# EAGLE design brushless (EAGLE 5.10)
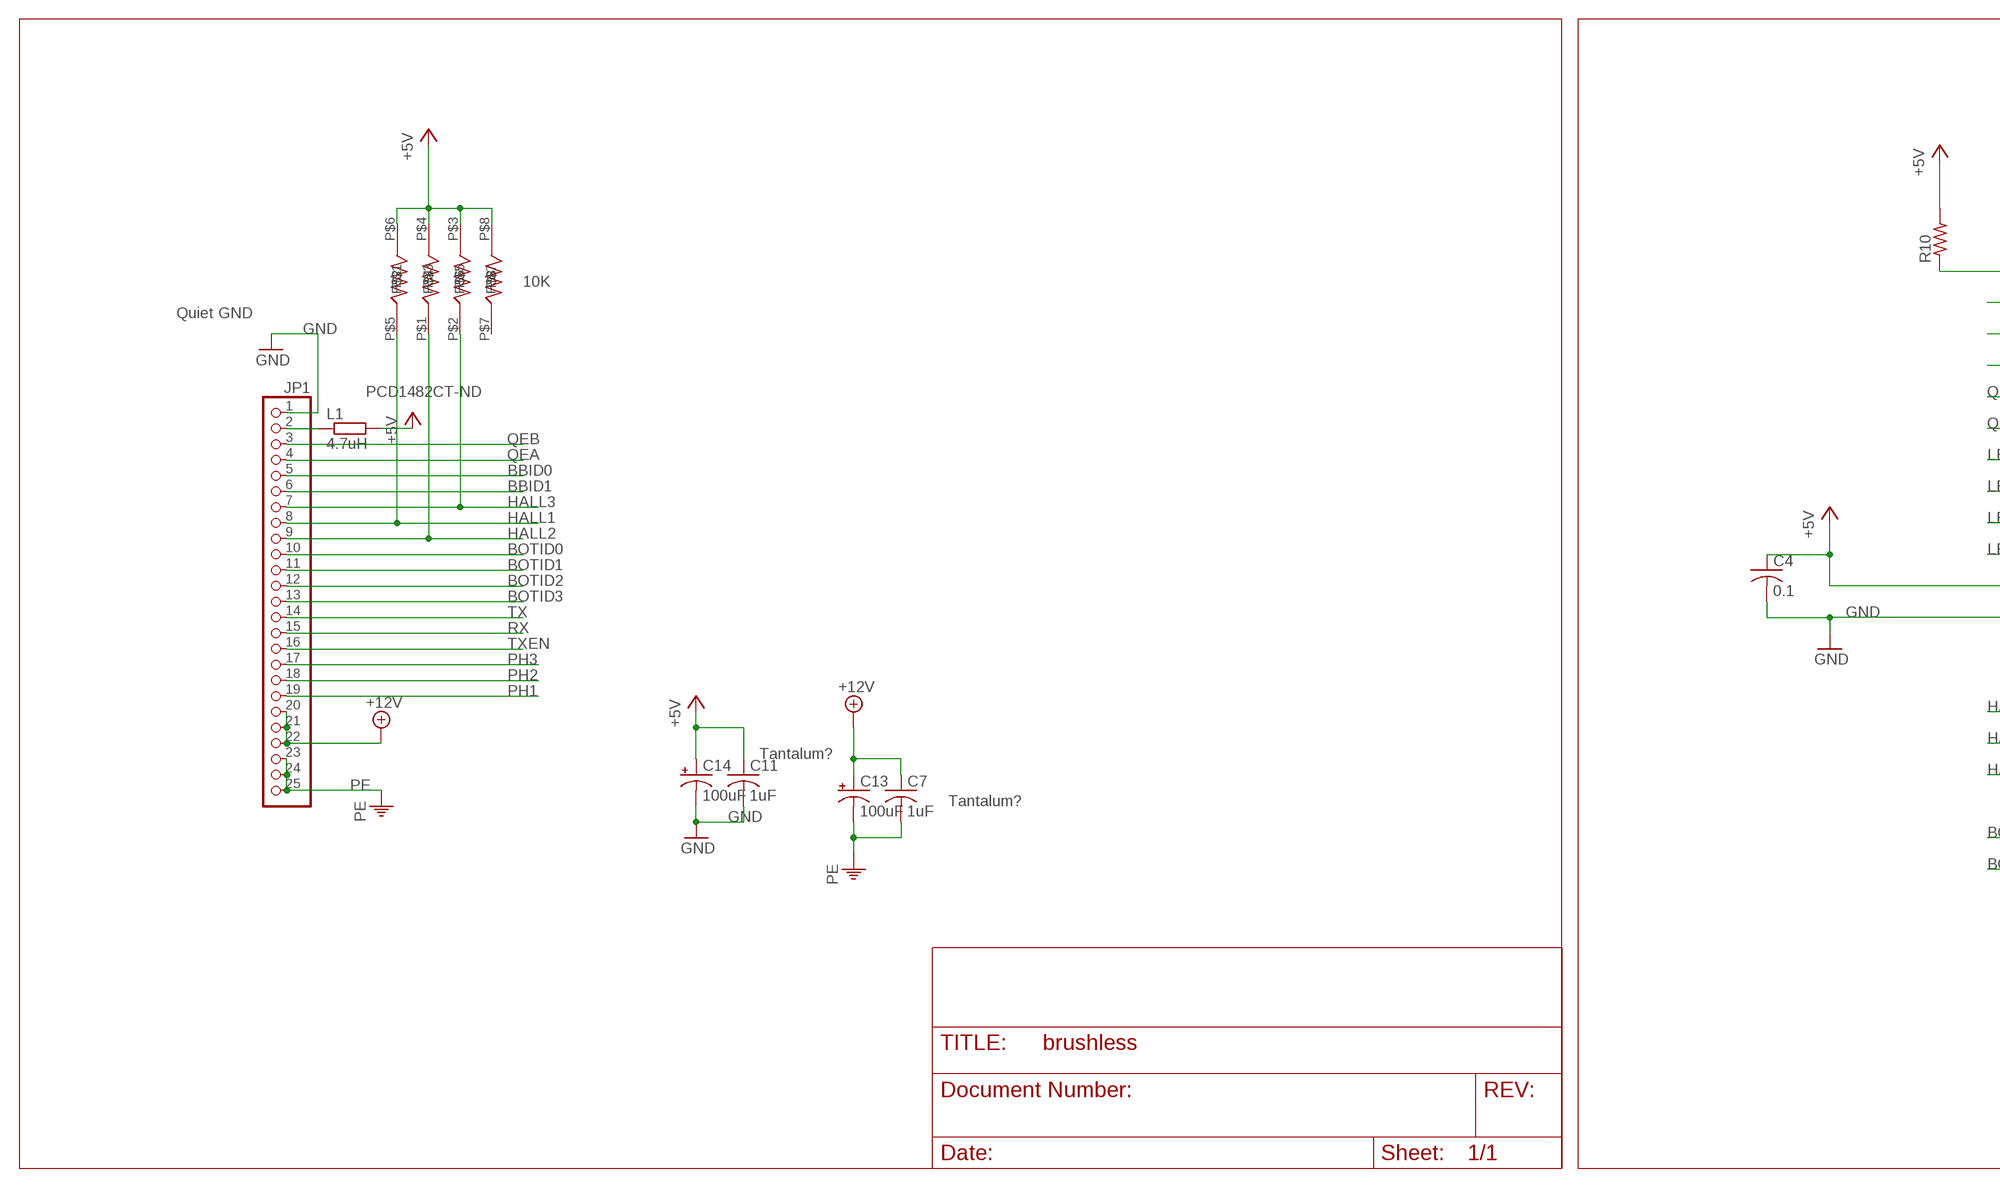
[diagram p0: schematic, sheet 1, part 1 of 2]
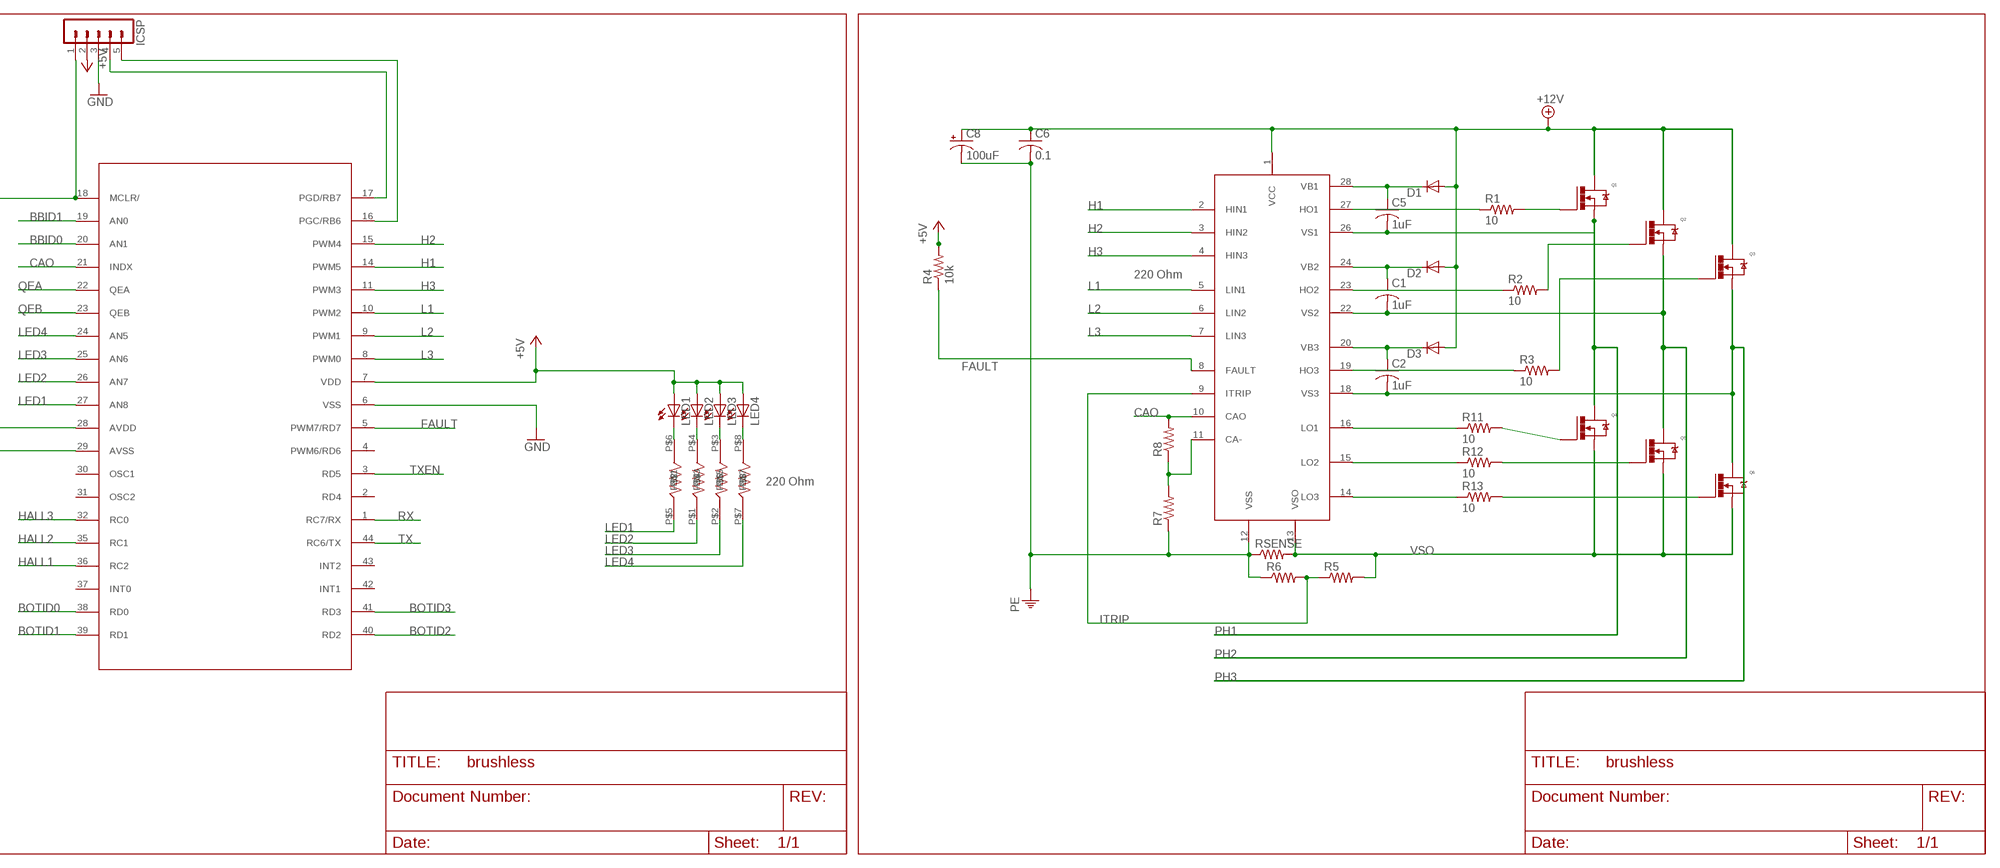
[diagram p1: schematic, sheet 1, part 2 of 2]

## Parts
C1  1uF  C-USC1210  [C1210]
C2  1uF  C-USC1210  [C1210]
C4  0.1  C-USC0805  [C0805]
C5  1uF  C-USC1210  [C1210]
C6  0.1  C-USC0805  [C0805]
C7  1uF  C-USC1210  [C1210]
C8  100uF  CPOL-USE2.5-5  [E2,5-5]
C11  1uF  C-USC1210  [C1210]
C13  100uF  CPOL-USE2.5-5  [E2,5-5]
C14  100uF  CPOL-USE2.5-5  [E2,5-5]
D1  DIODE-MINIMELF  [MINIMELF]
D2  DIODE-MINIMELF  [MINIMELF]
D3  DIODE-MINIMELF  [MINIMELF]
IC1  PIC18F4431S  [TQFP44]
IC2  IR2130S  [SOP28]
ICSP  MA05-1  [MA05-1]
JP1  PINHD-1X25  [1X25]
L1  4.7uH  R-EU_R3225  [R3225]
LED1  LEDCHIPLED_0805  [CHIPLED_0805]
LED2  LEDCHIPLED_0805  [CHIPLED_0805]
LED3  LEDCHIPLED_0805  [CHIPLED_0805]
LED4  LEDCHIPLED_0805  [CHIPLED_0805]
Q1  N-MOSFET  [DPAK]
Q2  N-MOSFET  [DPAK]
Q3  N-MOSFET  [DPAK]
Q4  N-MOSFET  [DPAK]
Q5  N-MOSFET  [DPAK]
Q6  N-MOSFET  [DPAK]
R1  10  R-US_R0805  [R0805]
R2  10  R-US_R0805  [R0805]
R3  10  R-US_R0805  [R0805]
R4  10k  R-US_R0805  [R0805]
R5  R-US_R0805  [R0805]
R6  R-US_R0805  [R0805]
R7  R-US_R0805  [R0805]
R8  R-US_R0805  [R0805]
R10  R-US_R0805  [R0805]
R11  10  R-US_R0805  [R0805]
R12  10  R-US_R0805  [R0805]
R13  10  R-US_R0805  [R0805]
RSENSE  R-US_R2010  [R2010]
U$1  10K  YC164J-10KCT-ND  [0603X4]
U$2  220  YC164J-10KCT-ND  [0603X4]

## Nets
+5MB: JP1.2 L1.1
+5V: C4.1 C11.1 C14.+ IC1.7(VDD) IC1.28(AVDD) ICSP.2 L1.2 LED1.A LED2.A LED3.A LED4.A R4.2 R10.2 U$1.P$3 U$1.P$4 U$1.P$6 U$1.P$8
+12V: C6.1 C7.1 C8.+ C13.+ D1.A D2.A D3.A IC2.1(VCC) JP1.20 JP1.21 JP1.22 Q1.DRAIN Q2.DRAIN Q3.DRAIN
BBID0: IC1.20(AN1) JP1.5
BBID1: IC1.19(AN0) JP1.6
BOTID0: IC1.38(RD0) JP1.10
BOTID1: IC1.39(RD1) JP1.11
BOTID2: IC1.40(RD2) JP1.12
BOTID3: IC1.41(RD3) JP1.13
CA-: IC2.11(CA-) R7.2 R8.1
CAO: IC1.21(INDX) IC2.10(CAO) R8.2
FAULT: IC1.5(PWM7/RD7) IC2.8(FAULT) R4.1
GND: C4.2 C11.2 C14.- IC1.6(VSS) IC1.29(AVSS) ICSP.3 JP1.1
H1: IC1.14(PWM5) IC2.2(HIN1)
H2: IC1.15(PWM4) IC2.3(HIN2)
H3: IC1.11(PWM3) IC2.4(HIN3)
HALL1: IC1.36(RC2) JP1.8 U$1.P$5
HALL2: IC1.35(RC1) JP1.9 U$1.P$1
HALL3: IC1.32(RC0) JP1.7 U$1.P$2
ITRIP: IC2.9(ITRIP) R5.1 R6.2
L1: IC1.10(PWM2) IC2.5(LIN1)
L2: IC1.9(PWM1) IC2.6(LIN2)
L3: IC1.8(PWM0) IC2.7(LIN3)
LED1: IC1.27(AN8) U$2.P$5
LED2: IC1.26(AN7) U$2.P$1
LED3: IC1.25(AN6) U$2.P$2
LED4: IC1.24(AN5) U$2.P$7
N$1: IC2.27(HO1) R1.1
N$2: LED1.C U$2.P$6
N$3: LED2.C U$2.P$4
N$4: C5.1 D1.C IC2.28(VB1)
N$5: C1.1 D2.C IC2.24(VB2)
N$6: Q1.GATE R1.2
N$7: C2.1 D3.C IC2.20(VB3)
N$8: LED3.C U$2.P$3
N$9: IC1.18(MCLR/) ICSP.1 R10.1
N$12: IC2.16(LO1) R11.1
N$13: Q4.GATE R11.2
N$14: IC2.15(LO2) R12.1
N$15: IC2.14(LO3) R13.1
N$16: Q5.GATE R12.2
N$17: Q6.GATE R13.2
N$18: IC2.23(HO2) R2.1
N$19: Q2.GATE R2.2
N$20: Q3.GATE R3.2
N$21: IC2.19(HO3) R3.1
N$22: IC1.17(PGD/RB7) ICSP.4
N$23: IC1.16(PGC/RB6) ICSP.5
N$26: LED4.C U$2.P$8
PE: C6.2 C7.2 C8.- C13.- IC2.12(VSS) JP1.23 JP1.24 JP1.25 R6.1 R7.1 RSENSE.1
PH1: C5.2 IC2.26(VS1) JP1.19 Q1.SOURCE Q4.DRAIN
PH2: C1.2 IC2.22(VS2) JP1.18 Q2.SOURCE Q5.DRAIN
PH3: C2.2 IC2.18(VS3) JP1.17 Q3.SOURCE Q6.DRAIN
QEA: IC1.22(QEA) JP1.4
QEB: IC1.23(QEB) JP1.3
RX: IC1.1(RC7/RX) JP1.15
TX: IC1.44(RC6/TX) JP1.14
TXEN: IC1.3(RD5) JP1.16
VSO: IC2.13(VSO) Q4.SOURCE Q5.SOURCE Q6.SOURCE R5.2 RSENSE.2
Unconnected: IC1.2(RD4) IC1.4(PWM6/RD6) IC1.30(OSC1) IC1.31(OSC2) IC1.37(INT0) IC1.42(INT1) IC1.43(INT2) U$1.P$7

## Notes on the sheet
- 10K
- Quiet GND
- 220 Ohm
- PCD1482CT-ND
- 220 Ohm
- Tantalum?
- Tantalum?

## Library data of the parts
C1 C2 C4-C7 C11 = rcl:C-US: CAPACITOR, American symbol
C8 C13 C14 = rcl:CPOL-US: POLARIZED CAPACITOR, American symbol
D1-D3 = diode:DIODE-: DIODE
IC1 = microchip:PIC18F4431
IC2 = transistor-fet:IR2130
ICSP = con-lstb:MA05-1: PIN HEADER
JP1 = pinhead:PINHD-1X25: PIN HEADER
L1 = resistor:R-EU_: RESISTOR, European symbol
LED1-LED4 = led:LED: LED OSRAM: - CHIPLED LG R971, LG N971, LY N971, LG Q971, LY Q971, LO R971, LY R971 LH N974, LH R974 LS Q976, LO Q976, LY Q976 LO Q996 - Hyper CHIPLED LW Q18S LB Q993, LB Q99A, LB R99A - SideLED LS A670, LO A670, LY A670, LG A670, LP A670 LB A673, LV A673, LT A673, LW A673 LH A674 LY A675 LS A676, LA A676, LO A676, LY A676, LW A676 LS A679, LY A679, LG A679 - Hyper Micro SIDELED® LS Y876, LA Y876, LO Y876, LY Y876 LT Y87S - SmartLED LW L88C, LW L88S LB L89C, LB L89S, LG L890 LS L89K, LO L89K, LY L89K LS L896, LA L896, LO L896, LY L896 - TOPLED LS T670, LO T670, LY T670, LG T670, LP T670 LSG T670, LSP T670, LSY T670, LOP T670, LYG T670 LG T671, LOG T671, LSG T671 LB T673, LV T673, LT T673, LW T673 LH T674 LS T676, LA T676, LO T676, LY T676, LB T676, LH T676, LSB T676, LW T676 LB T67C, LV T67C, LT T67C, LS T67K, LO T67K, LY T67K, LW E67C LS E67B, LA E67B, LO E67B, LY E67B, LB E67C, LV E67C, LT E67C LW T67C LS T679, LY T679, LG T679 LS T770, LO T770, LY T770, LG T770, LP T770 LB T773, LV T773, LT T773, LW T773 LH T774 LS E675, LA E675, LY E675, LS T675 LS T776, LA T776, LO T776, LY T776, LB T776 LHGB T686 LT T68C, LB T68C - Hyper Mini TOPLED® LB M676 - Mini TOPLED Santana® LG M470 LS M47K, LO M47K, LY M47K Source: http://www.osram.convergy.de LUXEON: - LUMILED® LXK2-PW12-R00, LXK2-PW12-S00, LXK2-PW14-U00, LXK2-PW14-V00 LXK2-PM12-R00, LXK2-PM12-S00, LXK2-PM14-U00 LXK2-PE12-Q00, LXK2-PE12-R00, LXK2-PE12-S00, LXK2-PE14-T00, LXK2-PE14-U00 LXK2-PB12-K00, LXK2-PB12-L00, LXK2-PB12-M00, LXK2-PB14-N00, LXK2-PB14-P00, LXK2-PB14-Q00 LXK2-PR12-L00, LXK2-PR12-M00, LXK2-PR14-Q00, LXK2-PR14-R00 LXK2-PD12-Q00, LXK2-PD12-R00, LXK2-PD12-S00 LXK2-PH12-R00, LXK2-PH12-S00 LXK2-PL12-P00, LXK2-PL12-Q00, LXK2-PL12-R00 Source: www.luxeon.com KINGBRIGHT: KA-3528ASYC Source: www.kingbright.com
Q1-Q6 = rfc:N-MOSFET: N-Channel Power Mosfet
R1-R8 R10-R13 RSENSE = rcl:R-US_: RESISTOR, American symbol
U$1 U$2 = rfc:YC164J-10KCT-ND: 4 pack of resistors

## Board
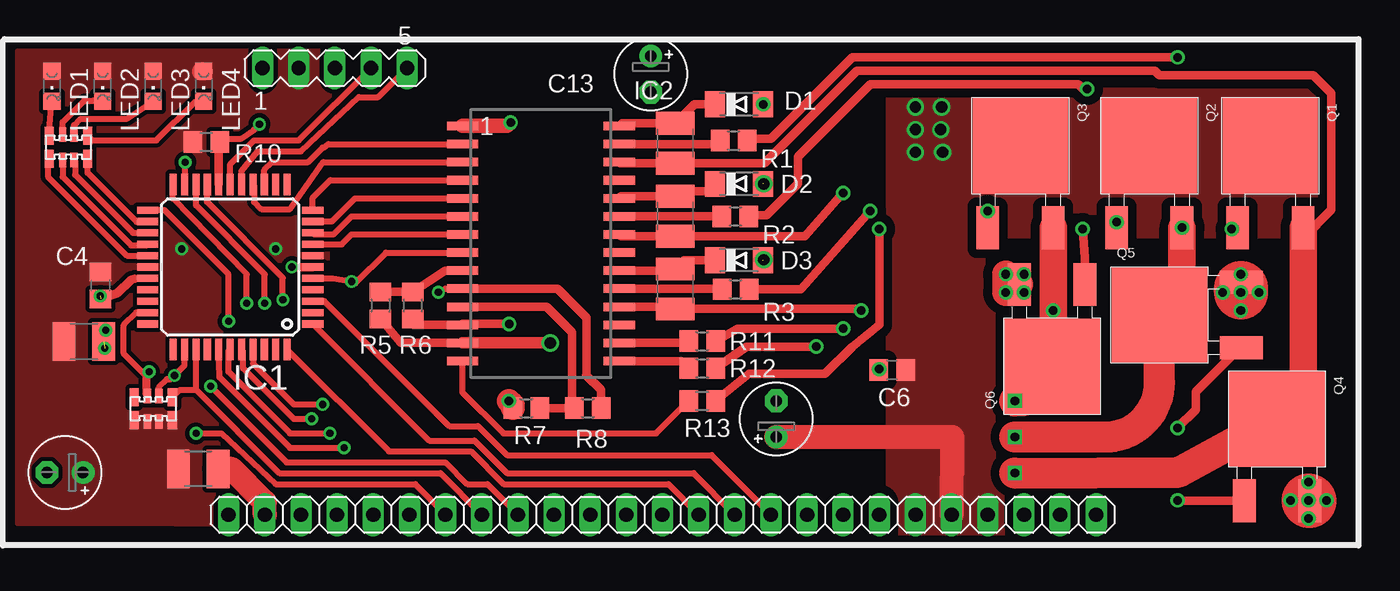
[diagram p2: board, top side]
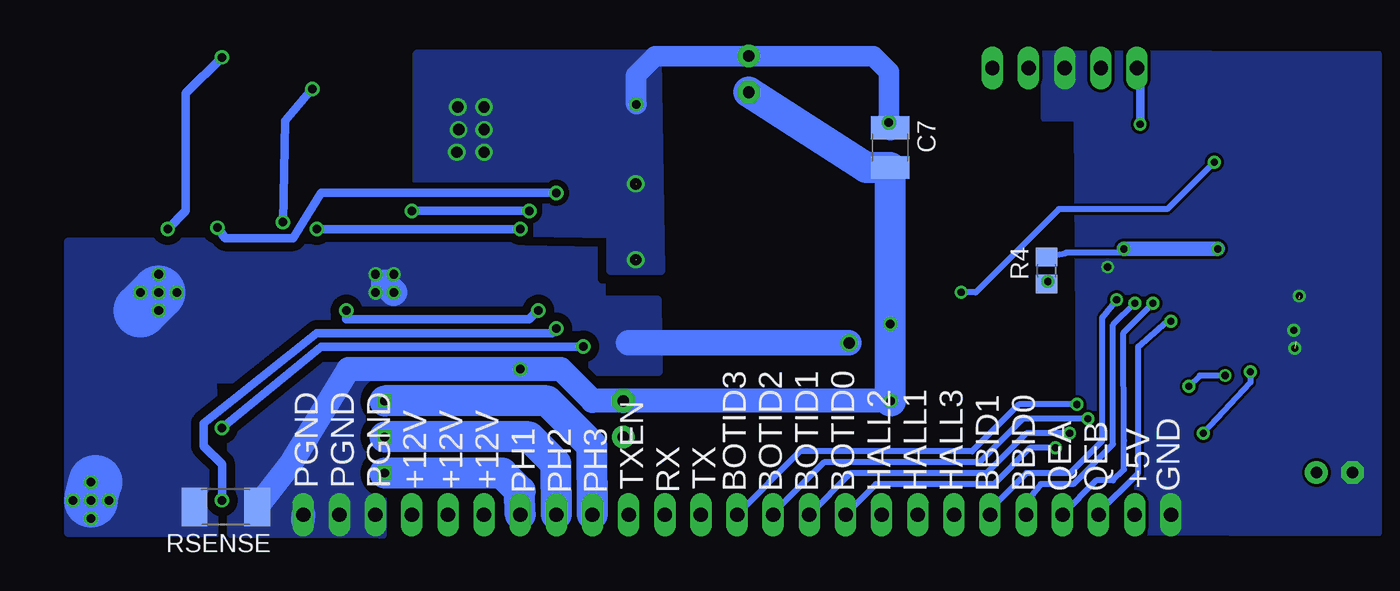
[diagram p3: board, bottom side, seen from below]

No outline drawn. Coordinates in mm, seen from the top.
Copper layers (1*16): Top 0.035mm / dielectric 1.5mm / Bottom 0.035mm
Design rules "default": minimum track width 10mil, minimum drill 24mil, track to track 8mil, track to pad 8mil, pad to pad 8mil, via to via 8mil, smd to smd 8mil, copper to edge 40mil, drill to drill 8mil, minimum pad ring 10mil, minimum via ring 8mil, stop-mask expansion 4mil, vias tented up to drill 0mil, thermal gap 10mil

### Footprints (pad centres in the part's own frame; a part is rotated, then mirrored left to right if it is on the bottom)
C1210 = smd 1.6 x 2.7: 1 -1.4,0; 2 1.4,0
C0805 = smd 1.3 x 1.5: 1 -0.95,0; 2 0.95,0
E2,5-5 = drill 0.813 pad 1.6 round: + -1.27,0 | drill 0.813 pad 1.6 octagon: - 1.27,0
MINIMELF = smd 1.4 x 1.8: A 1.7,0; C -1.7,0
TQFP44@1 = smd 1.5 x 0.5: 1 -5.8,4; 2 -5.8,3.2; 3 -5.8,2.4; 4 -5.8,1.6; 5 -5.8,0.8; 6 -5.8,0; 7 -5.8,-0.8; 8 -5.8,-1.6; 9 -5.8,-2.4; 10 -5.8,-3.2; 11 -5.8,-4; 23 5.8,-4; 24 5.8,-3.2; 25 5.8,-2.4; 26 5.8,-1.6; 27 5.8,-0.8; 28 5.8,0; 29 5.8,0.8; 30 5.8,1.6; 31 5.8,2.4; 32 5.8,3.2; 33 5.8,4 | smd 0.5 x 1.5: 12 -4,-5.8; 13 -3.2,-5.8; 14 -2.4,-5.8; 15 -1.6,-5.8; 16 -0.8,-5.8; 17 0,-5.8; 18 0.8,-5.8; 19 1.6,-5.8; 20 2.4,-5.8; 21 3.2,-5.8; 22 4,-5.8; 34 4,5.8; 35 3.2,5.8; 36 2.4,5.8; 37 1.6,5.8; 38 0.8,5.8; 39 0,5.8; 40 -0.8,5.8; 41 -1.6,5.8; 42 -2.4,5.8; 43 -3.2,5.8; 44 -4,5.8
SOP28 = smd 0.6 x 2.2: 1 -8.255,-5.5; 2 -6.985,-5.5; 3 -5.715,-5.5; 4 -4.445,-5.5; 5 -3.175,-5.5; 6 -1.905,-5.5; 7 -0.635,-5.5; 8 0.635,-5.5; 9 1.905,-5.5; 10 3.175,-5.5; 11 4.445,-5.5; 12 5.715,-5.5; 13 6.985,-5.5; 14 8.255,-5.5; 15 8.255,5.5; 16 6.985,5.5; 17 5.715,5.5; 18 4.445,5.5; 19 3.175,5.5; 20 1.905,5.5; 21 0.635,5.5; 22 -0.635,5.5; 23 -1.905,5.5; 24 -3.175,5.5; 25 -4.445,5.5; 26 -5.715,5.5; 27 -6.985,5.5; 28 -8.255,5.5
MA05-1 = drill 1.016 long: 1 -5.08,0; 2 -2.54,0; 3 0,0; 4 2.54,0; 5 5.08,0
1X25 = drill 1.016 long: 1 -29.21,0; 2 -26.67,0; 3 -24.13,0; 4 -21.59,0; 5 -19.05,0; 6 -16.51,0; 7 -13.97,0; 8 -11.43,0; 9 -8.89,0; 10 -6.35,0; 11 -3.81,0; 12 -1.27,0; 13 1.27,0; 14 3.81,0; 15 6.35,0; 16 8.89,0; 17 11.43,0; 18 13.97,0; 19 16.51,0; 20 19.05,0; 21 21.59,0; 22 24.13,0; 23 26.67,0; 24 29.21,0; 25 31.75,0
R3225 = smd 1.6 x 2.7: 1 -1.4,0; 2 1.4,0
CHIPLED_0805 = smd 1.2 x 1.2: A 0,-1.05; C 0,1.05
DPAK = smd 6.7 x 6.7: DRAIN 0,0 | smd 3 x 1.6: GATE 5.75,-2.3; SOURCE 5.75,2.3
R0805 = smd 1.3 x 1.5: 1 -0.95,0; 2 0.95,0
R2010 = smd 1.8 x 2.7: 1 -2.2,0; 2 2.2,0
0603X4 = smd 0.508 x 1.016: P$1 1.2,-0.1; P$2 2,-0.1; P$3 2,1.7; P$4 1.2,1.7 | smd 0.635 x 1.27: P$5 0.25,0; P$6 0.25,1.6; P$7 2.95,0; P$8 2.95,1.6

### Placement (x,y rotation side)
C1  47.27,23.13 270 top
C2  47.27,18.02 270 top
C4  6.87,18.27 270 top
C5  47.27,28.25 270 top
C6  62.48,12.32 180 top
C7  35.59,27.95 270 bottom
C8  54.36,8.89 90 top
C11  5.7,14.33 0 top
C13  45.53,33.11 270 top
C14  4.38,5.13 180 top
D1  51.73,30.99 0 top
D2  51.73,25.4 0 top
D3  51.73,20.03 0 top
IC1  [TQFP44@1]  15.98,19.56 180 top
IC2  37.81,21.21 270 top
ICSP  23.34,33.53 0 top
JP1  45.09,2.16 0 top
L1  13.74,5.38 180 top
LED1  3.46,32.26 180 top
LED2  7.02,32.26 180 top
LED3  10.57,32.26 180 top
LED4  14.13,32.26 180 top
Q1  89.07,28.07 270 top
Q2  80.56,28.07 270 top
Q3  71.51,28.07 270 top
Q4  89.53,8.89 270 top
Q5  81.28,16.19 0 top
Q6  73.74,12.58 90 top
R1  51.35,28.45 0 top
R2  51.48,23.11 0 top
R3  51.5,18 0 top
R4  24.61,19.3 90 bottom
R5  26.54,16.86 270 top
R6  28.83,16.86 90 top
R7  36.8,9.65 0 top
R8  41.12,9.65 0 top
R10  14.3,28.34 180 top
R11  49.15,14.35 0 top
R12  49.15,12.45 0 top
R13  49.15,10.16 0 top
RSENSE  82.27,2.7 180 bottom
U$1  12.18,10.4 180 top
U$2  3.02,27.18 0 top

### Tracks (layer width: path | path; a pad name or v marks a point on that pad's centre or on a via)
+5MB
  Top 1.676: L1.1 16.08,5.38 18.41,3.05 JP1.2
+5V  (via drill 0.5)
  Top 1.27: LED4.A 13.93,33.31
  Bottom 0.406: R4.2 23.31,20.51 23.24,20.57 19.43,20.57 v19.18,20.83
  Bottom 1.016: v12.57,20.83 v19.18,20.83
  pour Top (isolate 0.305, no thermals): 24.51,34.73 1.02,34.73 1.02,1.52 23.05,1.46 22.73,29.97 24.77,29.97 24.77,30.48
+12V  (via drill 0.6, 0.8)  (2 unrouted)
  Top 1.016: IC2.1 35.45,29.46 v35.69,29.7
  Top 1.676: C8.+ 66.71,7.62 JP1.21
  Bottom 1.422: v35.69,29.7 35.69,33.27 36.79,34.38 C13.+ 52.11,34.38 53.47,33.02 53.47,31.02 D1.A
  Bottom 1.778: v35.69,29.7 C7.1
  other vias: 64.14,29.21 65.91,29.21 64.14,27.62 64.14,30.8 65.98,30.8 66.04,27.62 53.47,25.4 53.47,20.07 53.44,30.99
  pour Bottom (isolate 0.406, rank 3, no thermals): 51.94,34.29 51.69,19.3 55.24,19.3 55.24,21.84 68.83,22.1 68.83,34.54 52.2,34.54
  pour Top (isolate 0.61, no thermals): 93.09,31.88 93.09,21.84 70.74,21.84 70.74,1.02 62.36,1.02 62.36,31.88
BBID0  (via drill 0.5)
  Top 0.406: IC1.20 13.59,23.88 18.41,19.05 v18.41,17.02
  Bottom 0.406: v18.41,17.02 19.94,15.49 19.94,7.11 22.73,4.32 25.02,4.32 26.07,3.02 JP1.5
BBID1  (via drill 0.5)
  Top 0.406: v19.68,17.27 19.68,18.8 14.35,24.13 14.35,25.32 IC1.19
  Bottom 0.406: v19.68,17.27 20.7,16 20.7,7.37 22.99,5.08 26.04,5.08 28.61,2.51 JP1.6
BOTID0  (via drill 0.5 pad 0.25)
  Top 0.406: v24,6.86 20.19,6.86 15.24,11.81 IC1.38
  Bottom 0.406: JP1.10 36.61,4.32 28.32,4.32 25.78,6.86 v24,6.86
BOTID1  (via drill 0.5 pad 0.25)
  Top 0.406: v22.99,7.87 20.19,7.87 15.88,12.19 15.88,13.65 IC1.39
  Bottom 0.406: JP1.11 38.39,5.08 28.83,5.08 26.04,7.87 v22.99,7.87
BOTID2  (via drill 0.5 pad 0.25)
  Top 0.406: v21.72,8.89 20.45,8.89 16.89,12.45 16.89,13.65 IC1.40
  Bottom 0.406: JP1.12 43.85,2.25 40.26,5.84 29.34,5.84 26.29,8.89 v21.72,8.89
BOTID3  (via drill 0.5 pad 0.25)
  Top 0.406: IC1.41 17.59,12.77 20.45,9.91 v22.48,9.91
  Bottom 0.406: v22.48,9.91 26.54,9.91 29.84,6.6 41.94,6.6 JP1.13
CA-
  Top 0.61: 40.01,9.65 R8.1 | IC2.11 38.23,16.76 40.01,14.99 40.01,9.65 | R7.2 40.01,9.65
CAO  (via drill 0.5)
  Top 0.406: IC2.10 31.11,18.03 v30.61,17.78 | v12.83,26.92 12.83,25.4 IC1.21
  Top 0.61: IC2.10 38.99,18.03 41.02,16 41.02,11.97 40.99,11.97 42.04,10.92 42.04,9.68 R8.2
  Bottom 0.406: v30.61,17.78 29.59,17.78 23.75,23.62 16.13,23.62 v12.83,26.92
FAULT  (via drill 0.5)
  Top 0.406: 23.1,18.76 IC1.5 23.2,18.76 v24.51,18.54 24.61,18.45 R4.1 24.67,18.41 24.77,18.41 26.92,20.57 IC2.8
  Bottom 0.406: v24.51,18.54 24.26,18.51 R4.1
GND  (via drill 0.5)  (2 unrouted)
  Top 0.406: 9.27,18.73 IC1.29
  Top 0.61: C4.2 8.05,17.7 9.02,18.67 9.27,18.73 | IC1.6 v20.32,19.56
  other vias: 7.24,15.11 7.18,13.84 6.86,17.53
  pour Bottom (no thermals): 1.27,0.83 22.25,0.89 22.48,29.97 24.79,29.97 24.79,34.62 1.27,34.56
H1
  Top 0.406: IC1.14 18.39,26.39 18.92,26.92 21.46,26.92 22.48,27.94 22.55,27.94 22.87,28.19 IC2.2
H2
  Top 0.406: IC1.15 17.65,25.29 17.65,24.13 18.16,23.62 20.19,23.62 22.52,26.91 22.52,26.92 IC2.3
H3
  Top 0.406: IC1.11 21.79,24.43 23.01,25.65 IC2.4
HALL1
  Top 0.406: JP1.8 30.77,5.08 19.43,5.08 13.59,10.93 | 13.59,10.93 IC1.36 | U$1.P$5 12.46,10.93 13.59,10.93
HALL2  (via drill 0.5)
  Top 0.406: JP1.9 34.07,4.32 32.64,4.32 31.11,5.84 19.94,5.84 v14.61,11.18 | IC1.35 12.79,12.66 v12.06,11.94 11.81,11.68 11.56,11.68 10.98,11.1 U$1.P$1
  Bottom 0.406: v14.61,11.18 13.84,11.94 v12.06,11.94
HALL3  (via drill 0.5)
  Top 0.406: IC1.32 9.37,16.36 8.51,15.49 8.51,13.46 10.03,11.94 10.03,10.64 U$1.P$2 10.18,12.08 v10.29,12.19 | v13.59,7.87 15.37,7.87 19.18,4.32 28.99,4.32 JP1.7
  Bottom 0.406: v10.29,12.19 10.29,11.43 v13.59,7.87
ITRIP
  Top 0.61: IC2.9 31.09,19.3 R6.2 R5.1
L1
  Top 0.406: IC1.10 23.14,22.76 24.51,24.13 24.5,24.13 24.75,24.38 IC2.5
L2
  Top 0.406: IC1.9 21.9,21.84 23.24,21.84 24.51,23.11 IC2.6
L3
  Top 0.406: IC1.8 23.82,21.16 24.51,21.84 IC2.7
LED1
  Top 0.406: IC1.27 8.72,20.36 3.17,25.91 3.17,27.09 U$2.P$5
LED2
  Top 0.406: U$2.P$1 4.21,25.88 9.02,21.08 10.11,21.08 IC1.26
LED3
  Top 0.406: IC1.25 9.16,21.96 5.08,26.04 5.08,27.01 U$2.P$2
LED4
  Top 0.406: U$2.P$7 5.96,26.17 9.4,22.73 10.16,22.73 IC1.24
N$1
  Top 0.61: IC2.27 50.41,28.19 R1.1
N$2
  Top 0.406: U$2.P$6 3.23,28.78 LED1.C
N$3
  Top 0.406: U$2.P$4 4.21,29.74 5.71,31.24 6.35,31.24 LED2.C
N$4
  Top 0.61: IC2.28 43.5,29.65 C5.1 48.6,30.99 D1.C
N$5
  Top 0.61: IC2.24 43.46,24.53 C1.1 47.63,24.89 50.16,24.89 50.03,25.02 D2.C
N$6  (via drill 0.6)
  Top 0.61: Q1.GATE 86.45,22.32 v86.36,22.23 | v82.55,34.29 59.69,34.29 53.98,28.57 52.43,28.57 R1.2
  Bottom 0.61: v86.36,22.23 85.09,23.5 85.09,31.75 v82.55,34.29
N$7
  Top 0.61: D3.C 47.89,20.03 C2.1 47.16,19.3 IC2.20
N$8
  Top 0.406: U$2.P$3 5.01,29.53 5.46,29.97 8.7,29.97 LED3.C
N$9  (via drill 0.5)
  Top 0.406: 15.19,28.23 R10.1 | 15.51,28.56 16.76,28.57 17.65,29.21 v18.03,29.59
  Top 0.61: IC1.18 15.19,28.23 | v18.03,29.59 18.02,29.58 | R10.1 15.51,28.56
  Bottom 0.61: v18.03,29.59 18.03,33.31 ICSP.1
N$12
  Top 0.61: IC2.16 48.07,14.22 R11.1
N$13  (via drill 0.6)
  Top 0.61: Q4.GATE 82.58,3.14 v82.55,3.17 | v59.05,15.24 51.62,15.24 R11.2
  Bottom 0.61: v82.55,3.17 82.55,5.71 83.82,6.99 83.82,8.57 75.88,14.92 59.37,14.92 v59.05,15.24
N$14
  Top 0.61: IC2.15 47.69,12.95 R12.1
N$15
  Top 0.406: IC2.14 32.31,10.74 35.18,7.87 45.91,7.87 R13.1
N$16  (via drill 0.6)
  Top 0.61: Q5.GATE 86.92,13.89 83.82,10.79 83.82,9.53 v82.55,8.26 | v57.15,13.97 52.26,13.97 R12.2
  Bottom 0.61: v82.55,8.26 75.56,13.97 v57.15,13.97
N$17  (via drill 0.6)
  Top 0.61: R13.2 52.43,12.06 57.78,12.06 59.69,13.97 61.59,15.52 v61.59,22.23 | Q6.GATE 76.04,20.16 v75.88,22.23
  Bottom 0.61: v61.59,22.23 v75.88,22.23
N$18
  Top 0.61: IC2.23 R2.1
N$19  (via drill 0.6)
  Top 0.61: v78.26,22.7 Q2.GATE | v76.2,32.07 75.88,32.07 75.56,32.38 60.96,32.38 55.88,27.3 55.88,25.4 53.66,23.18 52.49,23.18 R2.2
  Bottom 0.61: v78.26,22.7 78.11,29.84 v76.2,32.07
N$20  (via drill 0.6)
  Top 0.61: R3.2 56.1,18 v60.96,23.5 | v69.22,23.5 Q3.GATE
  Bottom 0.61: v60.96,23.5 v69.22,23.5
N$21
  Top 0.61: IC2.19 50.33,18.03 R3.1
N$22
  Top 0.406: ICSP.4 20.8,28.45 17.65,28.45 15.98,26.78 IC1.17
N$23
  Top 0.406: ICSP.5 26.38,31.5 25.02,31.5 20.95,27.69 17.91,27.69 16.79,26.31 IC1.16
N$26
  Top 0.406: LED4.C 13.49,31.15 10.79,28.45 6.29,28.45 U$2.P$8
PE  (via drill 0.6)
  Top 0.305: C6.2 61.59,12.32 v61.59,12.38
  Top 0.61: R6.1 28.83,15.49 IC2.12 32.31,15.56 v35.59,15.56
  Top 1.676: R7.1 35.85,9.87 v35.56,10.16
  Bottom 1.676: JP1.25 76.87,1.78 | v35.56,10.16 C8.- 56.52,10.16 58.74,12.38 v61.59,12.38 73.66,12.38 77.62,5.88 RSENSE.1
  Bottom 2.184: C13.- 37.28,26.55 C7.2 v35.59,15.56 35.59,10.16 v35.56,10.16
  pour Bottom (isolate 0.61, rank 2, no thermals): 71.25,0.76 71.25,12.57 78.11,12.57 81.92,9.53 81.92,0.83 71.75,0.83
PH1  (via drill 0.6)
  Top 0.61: IC2.26 43.38,26.85 C5.2 53.52,26.85 60.01,33.34 80.96,33.34 81.28,33.02 92.08,33.02 93.34,31.75 93.34,23.57 91.37,21.59
  Top 1.93: Q1.SOURCE 91.37,21.59 91.37,10.72 Q4.DRAIN
  Top 2.184: v71.12,5.08 82.62,5.16 Q4.DRAIN
  Bottom 2.184: JP1.19 61.63,3.78 61.59,3.81 62.87,5.08 v71.12,5.08
PH2  (via drill 0.6)
  Top 0.61: IC2.22 43.43,21.73 C1.2 56.38,21.73 v59.05,24.77
  Top 1.93: Q2.SOURCE 82.86,15.87 Q5.DRAIN
  Top 2.184: v71.12,7.62 77.47,7.62 arc90 81.28,11.43 Q5.DRAIN
  Bottom 0.61: v59.05,24.77 75.56,24.77 77.15,22.23 77.56,21.59 82.32,21.59 Q2.SOURCE
  Bottom 2.184: JP1.18 59.09,5.75 60.96,7.62 v71.12,7.62
  other vias: 82.86,22.32
PH3  (via drill 0.6)
  Top 0.61: IC2.18 47.12,16.76 C2.2 60.22,16.62 v60.33,16.51
  Top 1.93: 73.81,13.14 v73.81,16.51 Q3.SOURCE
  Top 2.184: v71.12,10.16 71.75,10.2 Q6.DRAIN 73.81,13.14
  Bottom 0.61: v60.33,16.51 60.96,15.88 73.81,15.88 v73.81,16.51
  Bottom 2.184: JP1.17 56.55,7.02 59.69,10.16 v71.12,10.16
QEA  (via drill 0.5)
  Top 0.406: v17.14,17.02 17.14,19.05 11.94,24.38 11.94,25.18 IC1.22
  Bottom 0.406: v17.14,17.02 19.21,14.95 19.18,7.37 19.18,5.33 19.94,4.57 21.11,4.57 JP1.4
QEB  (via drill 0.5)
  Top 0.406: IC1.23 11.37,23.56 15.88,19.05 v15.88,15.75
  Bottom 0.406: v15.88,15.75 16.13,15.75 18.16,13.97 18.16,5.08 20.99,2.25 JP1.3
RX
  Top 0.406: JP1.15 48.55,5.08 35.43,5.08 33.15,7.37 29.98,7.37 IC1.1
TX
  Top 0.406: JP1.14 46.77,4.32 35.18,4.32 32.89,6.6 27.14,6.6 IC1.44
TXEN
  Top 0.406: IC1.3 22.59,17.16 31.37,8.38 33.4,8.38 35.43,6.35 49.82,6.35 JP1.16
VSO  (via drill 0.6, 0.8)
  Top 0.305: 87,18.1 87,18.46 Q5.SOURCE
  Top 0.61: IC2.13 27.97,14.22 R5.2
  Top 0.813: IC2.13 v38.48,14.22
  Top 1.93: Q6.SOURCE 71.2,18.33 v70.48,19.05 v70.48,17.78
  Top 3.81: Q4.SOURCE 91.79,3.14 v91.76,3.17 | v87,17.78 87,18.1
  Bottom 1.778: v38.48,14.22 53.98,14.22
  Bottom 1.93: v70.48,17.78 71.12,18.41
  Bottom 3.81: 88.27,16.51 v87,17.78 | v91.76,3.17 91.44,4.45
  other vias: 71.75,19.05 71.75,17.78 87,19.05 88.27,17.78 87,16.51 85.72,17.78 91.76,4.45 93.03,3.17 91.76,1.91 90.49,3.17
  pour Bottom (isolate 0.61, rank 6, no thermals): 51.88,12.19 51.94,17.27 55.88,17.27 55.88,21.34 93.34,21.34 93.34,0.89 82.93,0.89 83.19,11.68 75.82,11.68 75.82,13.08 65.41,13.08 65.41,11.43 62.87,11.43 62.36,12.19

### Text on the board
bNames: PGND | PGND | PGND | TXEN | +12V | +12V | +12V | +5V | PH3 | PH2 | PH1 | TX | RX | GND | QEB | QEA | BBID0 | BBID1 | HALL3 | HALL1 | HALL2 | BOTID0 | BOTID1 | BOTID2 | BOTID3
tValues: 10k
bDocu: RFC Cambridge | Dec. 2009 | Rev. 6